# Altium schematic sheet Схема электрическая.SchDoc
size 209 x 297 mm; PageSetup: Record=PageOptions|CenterHorizontal=True|CenterVertical=True|PrintScale=0.94|XCorrection=1.00|YCorrection=1.00|PrintKind=1|BorderSize=5000000|LeftOffset=0|BottomOffset=0|Orientation=1|PaperLength=1000|PaperWidth=1000|Scale=100|PaperSource=7|PrintQuality=-4|MediaType=1|DitherType=10|PaperKind=A4|PrintScaleMode=1; DecimalNumber: Децимальный номер; HeadOfSector: Нач. сектора; MainDevice: Перв.примен.; Name: Наименование
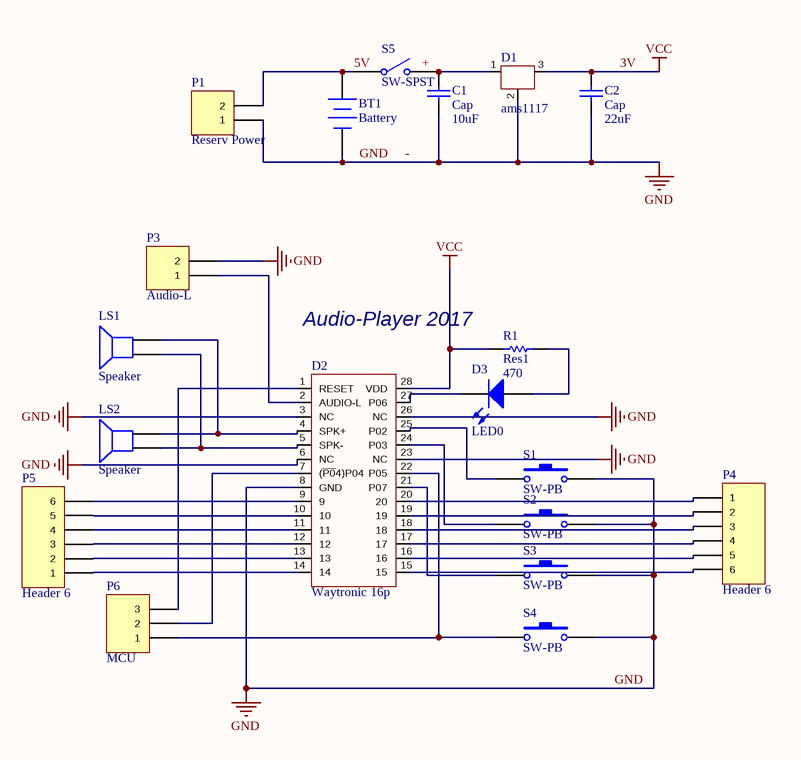
[diagram p0: Схема электрическая.SchDoc]

## Parts
BT1  Battery  [BAT-2]
C1  Cap  value 10uF  [RAD-0.3]
C2  Cap  value 22uF  [RAD-0.3]
D1  ams1117  [ams1117]
D2  Waytronic 16p  [Waytronic_16p]
D3  LED0  [LED-0]
LS1  Speaker  [PIN2]
LS2  Speaker  [PIN2]
P1  Reserv Power  [HDR1X2]
P3  Audio-L  [HDR1X2]
P4  Header 6  [HDR1X6]
P5  Header 6  [HDR1X6]
P6  MCU  [HDR1X3H]
R1  Res1  value 470  [AXIAL-0.3]
S1  SW-PB  [SPST-2]
S2  SW-PB  [SPST-2]
S3  SW-PB  [SPST-2]
S4  SW-PB  [SPST-2]
S5  SW-SPST  [SPST-2]

## Nets
3V: C2.2 D1.3(Vout) D2.28(VDD) R1.1  [also labelled VCC]
-: BT1.2(-) C1.1 C2.1 D1.2(GND) D2.3(NC) D2.6(NC) D2.8(GND) D2.23(NC) D2.26(NC) P1.1 P3.2 S1.2 S2.2 S3.2 S4.2  [also labelled GND]
NetBT1_1: BT1.1(+) P1.2 S5.1(COMMON)
NetC1_2: C1.2 D1.1(Vin) S5.2(NO)
NetD2_1: D2.1(RESET) P6.3
NetD2_2: D2.2(AUDIO-L) P3.1
NetD2_4: D2.4(SPK+) LS1.2 LS2.2
NetD2_5: D2.5(SPK-) LS1.1 LS2.1
NetD2_7: D2.7((~{P0}4)P04) P6.2
NetD2_9: D2.9 P5.6
NetD2_10: D2.10 P5.5
NetD2_11: D2.11 P5.4
NetD2_12: D2.12 P5.3
NetD2_13: D2.13 P5.2
NetD2_14: D2.14 P5.1
NetD2_15: D2.15 P4.6
NetD2_16: D2.16 P4.5
NetD2_17: D2.17 P4.4
NetD2_18: D2.18 P4.3
NetD2_19: D2.19 P4.2
NetD2_20: D2.20 P4.1
NetD2_21: D2.21(P07) S3.1
NetD2_22: D2.22(P05) P6.1 S4.1
NetD2_24: D2.24(P03) S2.1
NetD2_25: D2.25(P02) S1.1
NetD2_27: D2.27(P06) D3.2(K)
NetD3_1: D3.1(A) R1.2

## Notes on the sheet
- (near R1) Audio-Player 2017
- Labels drawn without touching a wire or pin: 5V, +
- Перв.примен.
- Справ.№
- Подп. и дата
- Инв.№ дубл.
- Взам.инв.№
- Подп.и дата
- Разраб.
- Изм.
- Лист
- № докум.
- Подп.
- Дата
- Лит.
- Масштаб
- Масса
- Т.контр.
- Пров.
- СХЕМА   ЭЛЕКТРИЧЕСКАЯ
- ПРИНЦИПИАЛЬНАЯ
- Листов
- Инв.№ подл.
- Утв.
- Н.контр.
- Нач.сект.
- Копировал
- Формат  A3

## Library data of the parts
BT1 = Battery: Multicell Battery; Published: 24-Mar-1999; LatestRevisionDate: 17-Jul-2002; LatestRevisionNote: Re-released for DXP Platform.; PackageReference: BAT-2; Publisher: Altium Limited; PackageDescription: Battery; 2 Leads
C1 C2 = Cap: Capacitor; Published: 8-Jun-2000; LatestRevisionDate: 17-Jul-2002; LatestRevisionNote: Re-released for DXP Platform.; PackageReference: RAD-0.3; Publisher: Altium Limited; PackageDescription: Radial Cap, Thru-Hole; 2 Leads; 0.3 in Pin Spacing
D3 = LED0: Typical INFRARED GaAs LED; Published: 8-Jun-2000; LatestRevisionDate: 08-Jul-2005; LatestRevisionNote: Mech Layer 1 removed.; PackageReference: LED-0; Publisher: Altium Limited; PackageDescription: LED; 2 Leads
LS1 LS2 = Speaker: Loudspeaker; Published: 24-Mar-1999; LatestRevisionDate: 17-Jul-2002; LatestRevisionNote: Re-released for DXP Platform.; PackageReference: PIN2; Publisher: Altium Limited
P1 P3 = Header 2: Header, 2-Pin; LatestRevisionDate: 17-Jul-2002; LatestRevisionNote: Re-released for DXP Platform.; Publisher: Altium Limited
P4 P5 = Header 6: Header, 6-Pin; LatestRevisionDate: 17-Jul-2002; LatestRevisionNote: Re-released for DXP Platform.; Publisher: Altium Limited
P6 = Header 3H: Header, 3-Pin, Right Angle; LatestRevisionDate: 17-Jul-2002; LatestRevisionNote: Re-released for DXP Platform.; Publisher: Altium Limited
R1 = Res1: Resistor; Published: 8-Jun-2000; LatestRevisionDate: 17-Jul-2002; LatestRevisionNote: Re-released for DXP Platform.; PackageReference: AXIAL-0.3; Publisher: Altium Limited; PackageDescription: Axial Device, Thru-Hole; 2 Leads; 0.3 in Pin Spacing
S1-S4 = SW-PB: Switch; Published: 24-Mar-1999; LatestRevisionDate: 17-Jul-2002; LatestRevisionNote: Re-released for DXP Platform.; PackageReference: SPST-2; Publisher: Altium Limited; PackageDescription: Switch; 2 Leads
S5 = SW-SPST: Single-Pole, Single-Throw Switch; Published: 24-Mar-1999; LatestRevisionDate: 17-Jul-2002; LatestRevisionNote: Re-released for DXP Platform.; PackageReference: SPST-2; Publisher: Altium Limited; PackageDescription: Switch; 2 Leads